# EasyEDA Pro project ProPrj_ax_driver_2025-11-09.epro, schematic axdr_v1.3
Board Name: 1.axdr_v1.3; Create Date: 2025-03-23; Page Name: P1; Project Name: 基于STM32G4的FOC电机驱动学习板; Schematic Name: axdr_v1.3; Update Date: 2025-03-23; Company: 嘉立创EDA
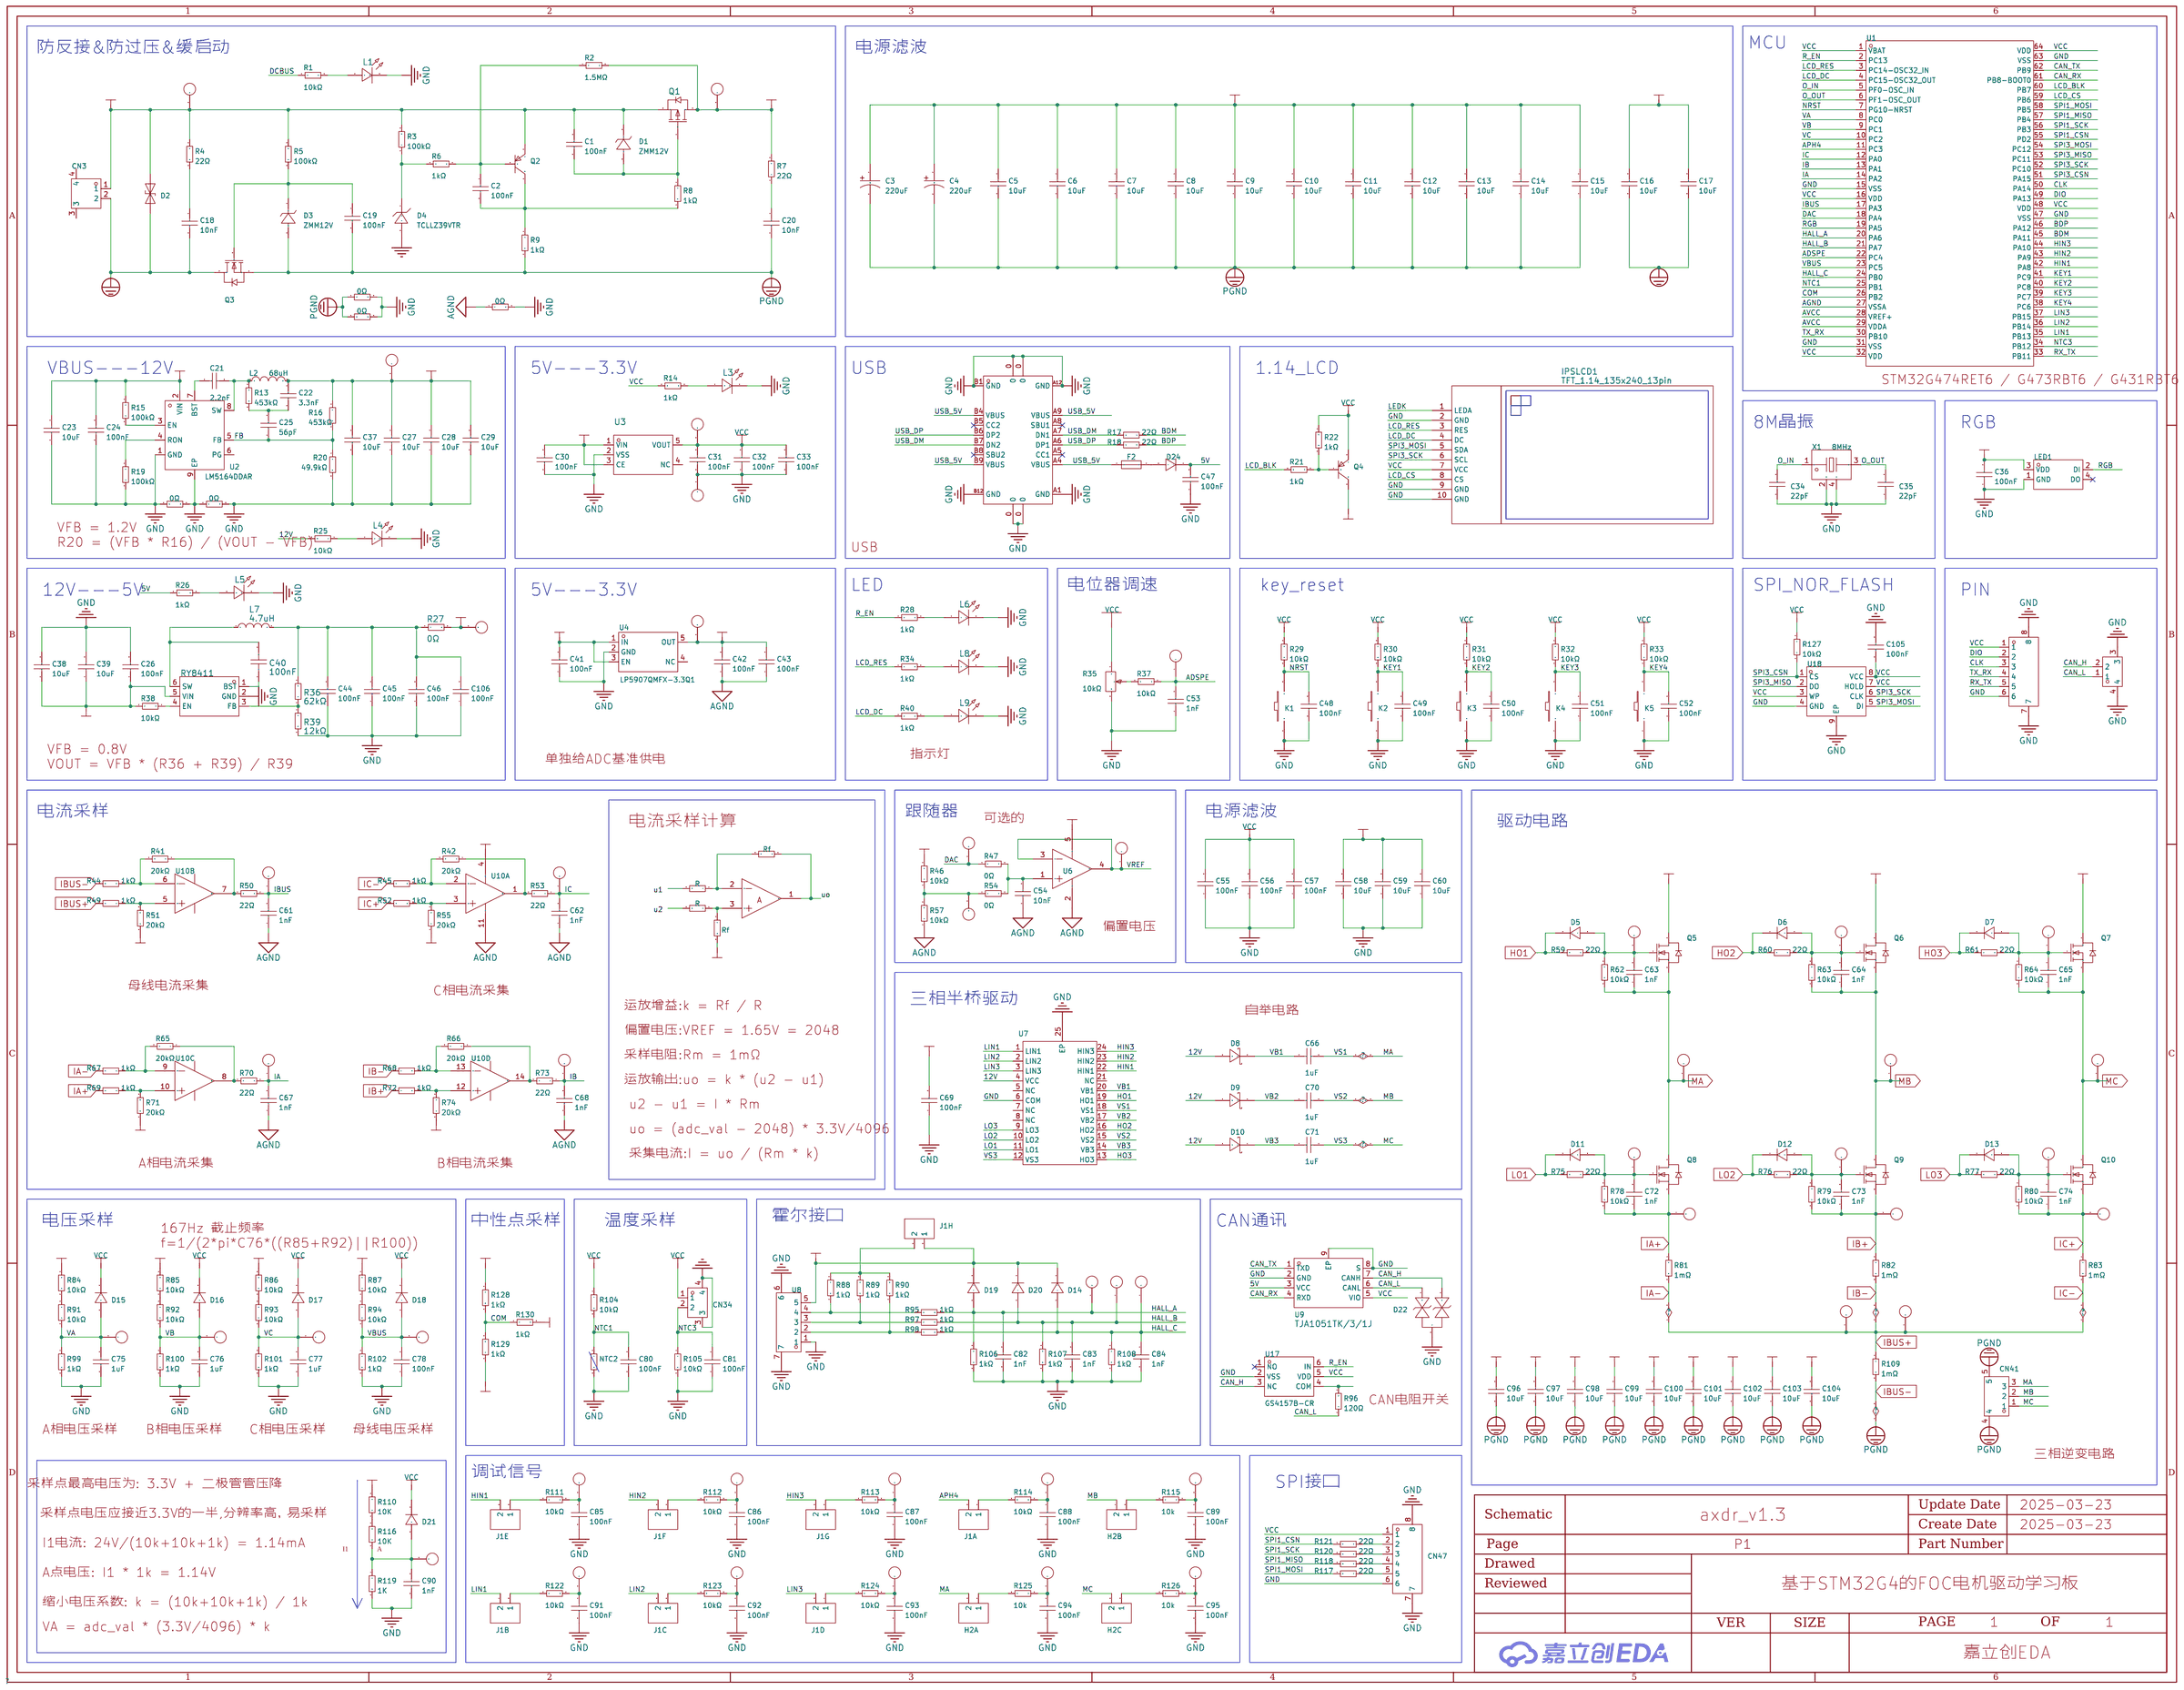
[diagram p1: schematic sheet]

## Parts
C1  100nF  [C0603_S]
C2  100nF  [C0603_S]
C3  220uF  [CAP-SMD_BD10.0-L10.3-W10.3-LS11.0-R-RD]
C4  220uF  [CAP-SMD_BD10.0-L10.3-W10.3-LS11.0-R-RD]
C5  10uF  [C1206_S]
C6  10uF  [C1206_S]
C7  10uF  [C1206_S]
C8  10uF  [C1206_S]
C9  10uF  [C1206_S]
C10  10uF  [C1206_S]
C11  10uF  [C1206_S]
C12  10uF  [C1206_S]
C13  10uF  [C1206_S]
C14  10uF  [C1206_S]
C15  10uF  [C1206_S]
C16  10uF  [C1206_S]
C17  10uF  [C1206_S]
C18  10nF  [C0603_S]
C19  100nF  [C0603_S]
C20  10nF  [C0603_S]
C21  2.2nF  [C0603_S]
C22  3.3nF  [C0603_S]
C23  10uF  [C1206_S]
C24  100nF  [C1206_S]
C25  2.2nF  [C0603_S]
C26  100nF  [C0603_S]
C27  10uF  [C0603_S]
C28  10uF  [C0603_S]
C29  10uF  [C1206_S]
C30  100nF  [C0603_S]
C31  100nF  [C0603_S]
C32  100nF  [C0603_S]
C33  100nF  [C0603_S]
C34  22pF  [C0603_S]
C35  22pF  [C0603_S]
C36  100nF  [C0603_S]
C37  10uF  [C0603_S]
C38  10uF  [C0603_S]
C39  10uF  [C0603_S]
C40  100nF  [C0603_S_3]
C41  100nF  [C0603_S]
C42  100nF  [C0603_S]
C43  100nF  [C0603_S]
C44  100nF  [C0603_S]
C45  100nF  [C0603_S]
C46  100nF  [C0603_S]
C47  100nF  [C0603_S]
C48  100nF  [C0603_S]
C49  100nF  [C0603_S]
C50  100nF  [C0603_S]
C51  100nF  [C0603_S]
C52  100nF  [C0603_S]
C53  1nF  [C0603_S]
C54  10nF  [C0603_S]
C55  100nF  [C0603_S]
C56  100nF  [C0603_S]
C57  100nF  [C0603_S]
C58  10uF  [C0603_S]
C59  10uF  [C0603_S]
C60  10uF  [C0603_S]
C61  1nF  [C0603_S]
C62  1nF  [C0603_S]
C63  1nF  [C0603_S]
C64  1nF  [C0603_S]
C65  1nF  [C0603_S]
C66  1uF  [C0603_S]
C67  1nF  [C0603_S]
C68  1nF  [C0603_S]
C69  100nF  [C0603_S]
C70  1uF  [C0603_S]
C71  1uF  [C0603_S]
C72  1nF  [C0603_S]
C73  1nF  [C0603_S]
C74  1nF  [C0603_S]
C75  1uF  [C0603_S]
C76  1uF  [C0603_S]
C77  1uF  [C0603_S]
C78  100nF  [C0603_S]
C80  100nF  [C0603_S]
C81  100nF  [C0603_S]
C82  1nF  [C0603_S]
C83  1nF  [C0603_S]
C84  1nF  [C0603_S]
C85  100nF  [C0603_S]
C86  100nF  [C0603_S]
C87  100nF  [C0603_S]
C88  100nF  [C0603_S]
C89  100nF  [C0603_S]  (no BOM)
C90  1nF  [C0603_S]  (no BOM)
C91  100nF  [C0603_S]
C92  100nF  [C0603_S]
C93  100nF  [C0603_S]
C94  100nF  [C0603_S]  (no BOM)
C95  100nF  [C0603_S]  (no BOM)
C96  10uF  [C1206_S]
C97  10uF  [C1206_S]
C98  10uF  [C1206_S]
C99  10uF  [C1206_S]
C100  10uF  [C1206_S]
C101  10uF  [C1206_S]
C102  10uF  [C1206_S]
C103  10uF  [C1206_S]
C104  10uF  [C1206_S]
C105  100nF  [C0603_S]
C106  100nF  [C0603_S]
CN1  5012  [TESTPOINT-TH_BD2.0_C9900010656]  (no BOM)
CN2  5012  [TESTPOINT-TH_BD2.0_C9900010656]  (no BOM)
CN3  XT30PW-F  [CONN-TH_XT30PW-F]
CN4  5012  [TESTPOINT-TH_BD2.0_C9900010656]  (no BOM)
CN5  5012  [TESTPOINT-TH_BD2.0_C9900010656]  (no BOM)
CN6  5012  [TESTPOINT-TH_BD2.0_C9900010656]  (no BOM)
CN7  5012  [TESTPOINT-TH_BD2.0_C9900010656]  (no BOM)
CN8  5012  [TESTPOINT-TH_BD2.0_C9900010656]  (no BOM)
CN9  WAFER-GH1.25-6PWB  [CONN-SMD_6P-P1.25_XUNPU_WAFER-GH1.25-6PWB]
CN10  5012  [TESTPOINT-TH_BD2.0_C9900010656]  (no BOM)
CN11  X1251WRS-02HF-LPSW  [CONN-SMD_2P-P1.25_X1251WRS-02HF-LPSW]
CN12  5012  [TESTPOINT-TH_BD2.0_C9900010656]  (no BOM)
CN13  5012  [TESTPOINT-TH_BD2.0_C9900010656]  (no BOM)
CN14  5012  [TESTPOINT-TH_BD2.0_C9900010656]  (no BOM)
CN15  5012  [TESTPOINT-TH_BD2.0_C9900010656]  (no BOM)
CN16  5012  [TESTPOINT-TH_BD2.0_C9900010656]  (no BOM)
CN17  5012  [TESTPOINT-TH_BD2.0_C9900010656]  (no BOM)
CN18  5012  [TESTPOINT-TH_BD2.0_C9900010656]  (no BOM)
CN19  5012  [TESTPOINT-TH_BD2.0_C9900010656]  (no BOM)
CN20  5012  [TESTPOINT-TH_BD2.0_C9900010656]  (no BOM)
CN21  5012  [TESTPOINT-TH_BD2.0_C9900010656]  (no BOM)
CN22  5012  [TESTPOINT-TH_BD2.0_C9900010656]  (no BOM)
CN23  5012  [TESTPOINT-TH_BD2.0_C9900010656]  (no BOM)
CN24  5012  [TESTPOINT-TH_BD2.0_C9900010656]  (no BOM)
CN25  5012  [TESTPOINT-TH_BD2.0_C9900010656]  (no BOM)
CN26  5012  [TESTPOINT-TH_BD2.0_C9900010656]  (no BOM)
CN27  5012  [TESTPOINT-TH_BD2.0_C9900010656]  (no BOM)
CN28  5012  [TESTPOINT-TH_BD2.0_C9900010656]  (no BOM)
CN29  5012  [TESTPOINT-TH_BD2.0_C9900010656]  (no BOM)
CN30  5012  [TESTPOINT-TH_BD2.0_C9900010656]  (no BOM)
CN31  5012  [TESTPOINT-TH_BD2.0_C9900010656]  (no BOM)
CN32  5012  [TESTPOINT-TH_BD2.0_C9900010656]  (no BOM)
CN33  5012  [TESTPOINT-TH_BD2.0_C9900010656]  (no BOM)
CN34  X1251WRS-02HF-LPSW  [CONN-SMD_2P-P1.25_X1251WRS-02HF-LPSW]
CN35  5012  [TESTPOINT-TH_BD2.0_C9900010656]  (no BOM)
CN36  5012  [TESTPOINT-TH_BD2.0_C9900010656]  (no BOM)
CN37  5012  [TESTPOINT-TH_BD2.0_C9900010656]  (no BOM)
CN38  5012  [TESTPOINT-TH_BD2.0_C9900010656]  (no BOM)
CN39  5012  [TESTPOINT-TH_BD2.0_C9900010656]  (no BOM)
CN40  5012  [TESTPOINT-TH_BD2.0_C9900010656]  (no BOM)
CN41  MR30PW-F  [CONN-TH_MR30PW-F]
CN42  5012  [TESTPOINT-TH_BD2.0_C9900010656]  (no BOM)
CN43  5012  [TESTPOINT-TH_BD2.0_C9900010656]  (no BOM)
CN44  5012  [TESTPOINT-TH_BD2.0_C9900010656]  (no BOM)
CN45  5012  [TESTPOINT-TH_BD2.0_C9900010656]  (no BOM)
CN46  5012  [TESTPOINT-TH_BD2.0_C9900010656]  (no BOM)
CN47  WAFER-GH1.25-6PWB  [CONN-SMD_6P-P1.25_XUNPU_WAFER-GH1.25-6PWB]
CN48  5012  [TESTPOINT-TH_BD2.0_C9900010656]  (no BOM)
CN49  5012  [TESTPOINT-TH_BD2.0_C9900010656]  (no BOM)
CN50  5012  [TESTPOINT-TH_BD2.0_C9900010656]  (no BOM)
CN51  5012  [TESTPOINT-TH_BD2.0_C9900010656]  (no BOM)
CN52  5012  [TESTPOINT-TH_BD2.0_C9900010656]  (no BOM)
CN53  5012  [TESTPOINT-TH_BD2.0_C9900010656]  (no BOM)
D1  ZMM12V  [LL-34_L3.5-W1.5-RD-2]
D2  1.5SMC30CAHE3/57T  [SMC_L6.8-W5.9-LS7.8-BI]
D3  ZMM12V  [LL-34_L3.5-W1.5-RD-2]
D4  TCLLZ39VTR  [LL-34_L3.5-W1.5-RD]
D5  B16WS  [SOD-323_L1.8-W1.3-LS2.5-RD]
D6  B16WS  [SOD-323_L1.8-W1.3-LS2.5-RD]
D7  B16WS  [SOD-323_L1.8-W1.3-LS2.5-RD]
D8  B16WS  [SOD-323_L1.8-W1.3-LS2.5-RD]
D9  B16WS  [SOD-323_L1.8-W1.3-LS2.5-RD]
D10  B16WS  [SOD-323_L1.8-W1.3-LS2.5-RD]
D11  B16WS  [SOD-323_L1.8-W1.3-LS2.5-RD]
D12  B16WS  [SOD-323_L1.8-W1.3-LS2.5-RD]
D13  B16WS  [SOD-323_L1.8-W1.3-LS2.5-RD]
D14  B16WS  [SOD-323_L1.8-W1.3-LS2.5-RD]
D15  B16WS  [SOD-323_L1.8-W1.3-LS2.5-RD]
D16  B16WS  [SOD-323_L1.8-W1.3-LS2.5-RD]
D17  B16WS  [SOD-323_L1.8-W1.3-LS2.5-RD]
D18  B16WS  [SOD-323_L1.8-W1.3-LS2.5-RD]
D19  B16WS  [SOD-323_L1.8-W1.3-LS2.5-RD]
D20  B16WS  [SOD-323_L1.8-W1.3-LS2.5-RD]
D21  -  [SOD-323_L1.8-W1.3-LS2.5-RD]  (no BOM)
D22  NUP2105LT1G  [SOT-23-3_L2.9-W1.3-P1.90-LS2.4-BR]
D24  B16WS  [SOD-323_L1.8-W1.3-LS2.5-RD]
F2  BSMD0603-050-6V  [F0603]
H2  X6521WV-2x03H-C60D30  [HDR-TH_6P-P2.54-V-M-R2-C3-S2.54]  (sections 1,2,3)  (no BOM)
IPSLCD1  TFT_1.14_135x240_13pin  [焊接式_TFT_1.14_135X240_13PIN]
J1  2.0-2*8P针  [HDR-TH_16P-P2.00-V-M-R2-C8-S2.00]  (sections 1,2,3,4,5,6,7,8)
K1  TS-KG02S  [SW-SMD_4P-L6.0-W6.0-P4.50-LS8.5]
K2  TS-KG02S  [SW-SMD_4P-L6.0-W6.0-P4.50-LS8.5]
K3  TS-KG02S  [SW-SMD_4P-L6.0-W6.0-P4.50-LS8.5]
K4  TS-KG02S  [SW-SMD_4P-L6.0-W6.0-P4.50-LS8.5]
K5  TS-KG02S  [SW-SMD_4P-L6.0-W6.0-P4.50-LS8.5]
L1  NCD0603R1  [LED0603_S]
L2  68uH  [IND-SMD_L6.0-W6.0_SMNR6045]
L3  NCD0603R1  [LED0603_S]
L4  NCD0603R1  [LED0603_S]
L5  NCD0603R1  [LED0603_S]
L6  NCD0603G1  [LED0603_S]
L7  4.7uH  [IND-SMD_L2.5-W2.0]
L8  NCD0603W1  [LED0603_S]
L9  NCD0603B1  [LED0603_S]
LED1  XL-3528RGBW-WS2812B  [LED-SMD_4P-L3.5-W2.8-BR-1]
NTC2  NCP18XH103F03RB  [R0603_S]
Q1  WSD90P06DN56  [DFN-8_L5.8-W4.9-P1.27-LS6.0-BL-1]
Q2  FMMT593  [SOT-23-3_L2.9-W1.3-P1.90-LS2.4-BR]
Q3  WSD80120DN56  [DFN-8_L5.8-W4.9-P1.27-LS6.0-BL-1]
Q4  S8550  [SOT-23-3_L2.9-W1.3-P1.90-LS2.4-BR]
Q5  NCE7560K  [TO-252-2_L6.6-W6.1-P4.58-LS9.9-BR]
Q6  NCE7560K  [TO-252-2_L6.6-W6.1-P4.58-LS9.9-BR]
Q7  NCE7560K  [TO-252-2_L6.6-W6.1-P4.58-LS9.9-BR]
Q8  NCE7560K  [TO-252-2_L6.6-W6.1-P4.58-LS9.9-BR]
Q9  NCE7560K  [TO-252-2_L6.6-W6.1-P4.58-LS9.9-BR]
Q10  NCE7560K  [TO-252-2_L6.6-W6.1-P4.58-LS9.9-BR]
R1  10kΩ  [R0603_S]
R2  1.5MΩ  [R0603_S]
R3  100kΩ  [R0603_S]
R4  22Ω  [R0603_S]
R5  100kΩ  [R0603_S]
R6  1kΩ  [R0603_S]
R7  22Ω  [R0603_S]
R8  1kΩ  [R0603_S]
R9  1kΩ  [R0603_S]
R10  0Ω  [R0603_S]
R11  0Ω  [R0603_S]
R12  0Ω  [R0603_S]
R13  453kΩ  [R0603_S]
R14  1kΩ  [R0603_S]
R15  100kΩ  [R0603_S]
R16  453kΩ  [R0603_S]
R17  22Ω  [R0603_S]
R18  22Ω  [R0603_S]
R19  100kΩ  [R0603_S]
R20  49.9kΩ  [R0603_S]
R21  1kΩ  [R0603_S]
R22  1kΩ  [R0603_S]
R23  0Ω  [R0603_S]
R24  0Ω  [R0603_S]
R25  10kΩ  [R0603_S]
R26  1kΩ  [R0603_S]
R27  0Ω  [R0603_S]
R28  1kΩ  [R0603_S]
R29  10kΩ  [R0603_S]
R30  10kΩ  [R0603_S]
R31  10kΩ  [R0603_S]
R32  10kΩ  [R0603_S]
R33  10kΩ  [R0603_S]
R34  1kΩ  [R0603_S]
R35  10kΩ  [RES-ADJ-TH_3P-L9.5-W9.5-P2.50-L_3386P]
R36  62kΩ  [R0603_S]
R37  10kΩ  [R0603_S]
R38  10kΩ  [R0603_S]
R39  12kΩ  [R0603_S]
R40  1kΩ  [R0603_S]
R41  20kΩ  [R0603_S]
R42  20kΩ  [R0603_S]
R43  Rf  [R0603_S]  (no BOM)
R44  1kΩ  [R0603_S]
R45  1kΩ  [R0603_S]
R46  10kΩ  [R0603_S]
R47  0Ω  [R0603_S]
R48  R  [R0603_S]  (no BOM)
R49  1kΩ  [R0603_S]
R50  22Ω  [R0603_S]
R51  20kΩ  [R0603_S]
R52  1kΩ  [R0603_S]
R53  22Ω  [R0603_S]
R54  0Ω  [R0603_S]
R55  20kΩ  [R0603_S]
R56  R  [R0603_S]  (no BOM)
R57  10kΩ  [R0603_S]
R58  Rf  [R0603_S]  (no BOM)
R59  22Ω  [R0603_S]
R60  22Ω  [R0603_S]
R61  22Ω  [R0603_S]
R62  10kΩ  [R0603_S]
R63  10kΩ  [R0603_S]
R64  10kΩ  [R0603_S]
R65  20kΩ  [R0603_S]
R66  20kΩ  [R0603_S]
R67  1kΩ  [R0603_S]
R68  1kΩ  [R0603_S]
R69  1kΩ  [R0603_S]
R70  22Ω  [R0603_S]
R71  20kΩ  [R0603_S]
R72  1kΩ  [R0603_S]
R73  22Ω  [R0603_S]
R74  20kΩ  [R0603_S]
R75  22Ω  [R0603_S]
R76  22Ω  [R0603_S]
R77  22Ω  [R0603_S]
R78  10kΩ  [R0603_S]
R79  10kΩ  [R0603_S]
R80  10kΩ  [R0603_S]
R81  1mΩ  [R2512_S]
R82  1mΩ  [R2512_S]
R83  1mΩ  [R2512_S]
R84  10kΩ  [R0603_S]
R85  15kΩ  [R0603_S]
R86  15kΩ  [R0603_S]
R87  15kΩ  [R0603_S]
R88  1kΩ  [R0603_S]
R89  1kΩ  [R0603_S]
R90  1kΩ  [R0603_S]
R91  15kΩ  [R0603_S]
R92  15kΩ  [R0603_S]
R93  15kΩ  [R0603_S]
R94  15kΩ  [R0603_S]
R95  1kΩ  [R0603_S]
R96  120Ω  [R0603_S]
R97  1kΩ  [R0603_S]
R98  1kΩ  [R0603_S]
R99  2kΩ  [R0603_S]
R100  2kΩ  [R0603_S]
R101  2kΩ  [R0603_S]
R102  2kΩ  [R0603_S]
R104  10kΩ  [R0603_S]
R105  10kΩ  [R0603_S]
R106  1kΩ  [R0603_S]
R107  1kΩ  [R0603_S]
R108  1kΩ  [R0603_S]
R109  1mΩ  [R2512_S]
R110  10K  [R0603_S]  (no BOM)
R111  10kΩ  [R0603_S]
R112  10kΩ  [R0603_S]
R113  10kΩ  [R0603_S]
R114  10kΩ  [R0603_S]
R115  10k  [R0603_S]  (no BOM)
R116  10K  [R0603_S]  (no BOM)
R117  22Ω  [R0603_S]
R118  22Ω  [R0603_S]
R119  1K  [R0603_S]  (no BOM)
R120  22Ω  [R0603_S]
R121  22Ω  [R0603_S]
R122  10kΩ  [R0603_S]
R123  10kΩ  [R0603_S]
R124  10kΩ  [R0603_S]
R125  10k  [R0603_S]  (no BOM)
R126  10k  [R0603_S]  (no BOM)
R127  10kΩ  [R0603_S]
R128  1kΩ  [R0603_S]
R129  1kΩ  [R0603_S]
R130  1kΩ  [R0603_S]
U1  STM32G431RBT6  [LQFP-64_L10.0-W10.0-P0.50-LS12.0-BL]
U2  LM5164DDAR  [ESOP-8_L4.9-W3.9-P1.27-LS6.0-BL-EP]
U3  XC6210B332MR  [SOT-23-5_L3.0-W1.7-P0.95-LS2.8-BR]
U4  LP5907QMFX-3.3Q1  [SOT-23-5_L3.0-W1.7-P0.95-LS2.8-BR]
U5  RY8411  [SOT-23-6_L2.9-W1.6-P0.95-LS2.8-BR]
U6  LM321MF/NOPB  [SOT-23-5_L3.0-W1.7-P0.95-LS2.8-BR]
U7  FD6288Q  [QFN-24_L4.0-W4.0-P0.50-BL-EP2.6]
U8  WAFER-GH1.25-5PWB  [CONN-SMD_5P-P1.25_XUNPU_WAFER-GH1.25-5PWB]
U9  TJA1051TK/3/1J  [HVSON-8_L3.0-W3.0-P0.65-BL-EP]
U10  RS624XQ  [TSSOP-14_L5.0-W4.4-P0.65-LS6.4-BL]  (sections 1,2,3,4)
U11  LM358  [SOP-8_L4.9-W3.9-P1.27-LS6.0-BL]  (section 1)  (no BOM)
U17  GS4157B-CR  [SC70-6_L2.1-W1.3-P0.65-LS2.3-BL]
U18  W25Q16JVUXIQ  [USON-8_L3.0-W2.0-P0.50-BL-EP]
USBC1  -  [USB-C_SMD-TYPE-C-31-M-12]
X1  8MHz  [CRYSTAL-SMD_4P-L3.2-W2.5-BL]

## Library data of the parts
C1 C2 C19 C26 C30-C33 C36 C41-C52 C55-C57 C69 C82-C88 C91-C93 C105 C106 = 0603B104K500NT: 容值:100nF;精度:±10%;额定电压:50V;材质(温度系数):X7R;; LCSC Part Name: 100nF ±10% 50V; Supplier Part: C30926; Manufacturer: FH(风华); Supplier Footprint: 0603; JLCPCB Part Class: Extended Part; Datasheet: https://atta.szlcsc.com/upload/public/pdf/source/20200305/C486355_26A10D38EF8C2A5C37091D0039909270.pdf; Supplier: LCSC; Tolerance: ±10%; Voltage Rated: 50V; Temperature Coefficient: X7R; Pin Type: IN; Check: true
C3 C4 = 50TZV220M10X10.5: 容值:220uF;精度:±20%;额定电压:50V;纹波电流:402mA@120Hz;等效串联电阻:-;; LCSC Part Name: 220uF ±20% 50V; Supplier Part: C88818; Manufacturer: rubycon(红宝石); Supplier Footprint: SMD,D10xL10.5mm; JLCPCB Part Class: Extended Part; Datasheet: https://atta.szlcsc.com/upload/public/pdf/source/20171014/C108861_15079752546651037911.pdf; Supplier: LCSC; Tolerance: ±20%; Rated Voltage: 50V; Ripple Current: 402mA@120Hz; φD: 10mm; L: 10.5mm; Lifetime @ Temp: 2000hrs@105℃; Operating Temperature: -55℃~+105℃; Check: true
C5-C17 C29 C96-C104 = CL31A106KBHNNNE: 容值:10uF;精度:±10%;额定电压:50V;材质(温度系数):X5R;; LCSC Part Name: 10uF ±10% 50V; Supplier Part: C13585; Manufacturer: SAMSUNG(三星); Supplier Footprint: 1206; JLCPCB Part Class: Basic Part; Datasheet: https://atta.szlcsc.com/upload/public/pdf/source/20160218/1457707763339.pdf; Supplier: LCSC; Tolerance: ±10%; Voltage Rated: 50V; Temperature Coefficient: X5R; Pin Type: IN; 值: 10UF; Check: true
C18 C20 C54 = 0603B103K500NT: 容值:10nF;精度:±10%;额定电压:50V;材质(温度系数):X7R;; LCSC Part Name: 10nF ±10% 50V; Supplier Part: C57112; Manufacturer: FH(风华); Supplier Footprint: 0603; JLCPCB Part Class: Basic Part; Datasheet: https://atta.szlcsc.com/upload/public/pdf/source/20200305/C486355_26A10D38EF8C2A5C37091D0039909270.pdf; Supplier: LCSC; Tolerance: ±10%; Voltage Rated: 50V; Temperature Coefficient: X7R; Pin Type: IN; Check: true
C21 C25 = 0603B222K500NT: 容值:2.2nF;精度:±10%;额定电压:50V;材质(温度系数):X7R;; LCSC Part Name: 2.2nF ±10% 50V; Supplier Part: C1604; Manufacturer: FH(风华); Supplier Footprint: 0603; JLCPCB Part Class: Basic Part; Datasheet: https://atta.szlcsc.com/upload/public/pdf/source/20200305/C486355_26A10D38EF8C2A5C37091D0039909270.pdf; Supplier: LCSC; Tolerance: ±10%; Voltage Rated: 50V; Temperature Coefficient: X7R; Pin Type: IN; Check: true
C22 = CL10B332KB8NNNC: 容值:3.3nF;精度:±10%;额定电压:50V;材质(温度系数):X7R;; LCSC Part Name: 3.3nF ±10% 50V; Supplier Part: C1613; Manufacturer: SAMSUNG(三星); Supplier Footprint: 0603; JLCPCB Part Class: Basic Part; Datasheet: https://atta.szlcsc.com/upload/public/pdf/source/20160218/1457707763339.pdf; Supplier: LCSC; Tolerance: ±10%; Voltage Rated: 50V; Temperature Coefficient: X7R; Pin Type: IN; Check: true
C23 = C1206_S: Pin Type: IN; Supplier Part: C13585; Check: true
C24 = CL31B104KBCNNNC: 容值:100nF;精度:±10%;额定电压:50V;材质(温度系数):X7R;; LCSC Part Name: 100nF ±10% 50V; Supplier Part: C24497; Manufacturer: SAMSUNG(三星); Supplier Footprint: 1206; JLCPCB Part Class: Basic Part; Datasheet: https://atta.szlcsc.com/upload/public/pdf/source/20160218/1457707763339.pdf; Supplier: LCSC; Tolerance: ±10%; Voltage Rated: 50V; Temperature Coefficient: X7R; Pin Type: IN; Check: true
C27 C28 C37-C39 C58-C60 = CL10A106MA8NRNC: 容值:10uF;精度:±20%;额定电压:25V;材质(温度系数):X5R;; LCSC Part Name: 10uF ±20% 25V; Supplier Part: C96446; Manufacturer: SAMSUNG(三星); Supplier Footprint: 0603; JLCPCB Part Class: Basic Part; Datasheet: https://atta.szlcsc.com/upload/public/pdf/source/20160218/1457707763339.pdf; Supplier: LCSC; Tolerance: ±20%; Voltage Rated: 25V; Temperature Coefficient: X5R; Pin Type: IN; Check: true
C34 C35 = 0603CG220J500NT: 容值:22pF;精度:±5%;额定电压:50V;材质(温度系数):C0G;; LCSC Part Name: 22pF ±5% 50V; Supplier Part: C91701; Manufacturer: FH(风华); Supplier Footprint: 0603; JLCPCB Part Class: Extended Part; Datasheet: https://atta.szlcsc.com/upload/public/pdf/source/20200305/C486355_26A10D38EF8C2A5C37091D0039909270.pdf; Supplier: LCSC; Tolerance: ±5%; Voltage Rated: 50V; Temperature Coefficient: C0G; Pin Type: IN; Check: true
C40 = CC0603KRX7R9BB104: 容值:100nF;精度:±10%;额定电压:50V;材质(温度系数):X7R;; LCSC Part Name: 100nF ±10% 50V; Supplier Part: C14663; Manufacturer: YAGEO(国巨); Supplier Footprint: 0603; JLCPCB Part Class: Basic Part; Datasheet: https://atta.szlcsc.com/upload/public/pdf/source/20180910/C282072_33301C7F631E79921B82A8DAC6BCC5B3.pdf; Supplier: LCSC; Tolerance: ±10%; Voltage Rated: 50V; Temperature Coefficient: X7R; Check: true
C53 C61-C65 C67 C68 C72-C78 C80 C81 = 0603B102K500NT: 容值:1nF;精度:±10%;额定电压:50V;材质(温度系数):X7R;; LCSC Part Name: 1nF ±10% 50V; Supplier Part: C44369; Manufacturer: FH(风华); Supplier Footprint: 0603; JLCPCB Part Class: Extended Part; Datasheet: https://atta.szlcsc.com/upload/public/pdf/source/20200305/C486355_26A10D38EF8C2A5C37091D0039909270.pdf; Supplier: LCSC; Tolerance: ±10%; Voltage Rated: 50V; Temperature Coefficient: X7R; Pin Type: IN; Check: true
C66 C70 C71 C89 C90 C94 C95 = C0603_S: Pin Type: IN; Supplier Part: C1604; Check: true
CN1 CN2 CN4-CN8 CN10 CN12-CN33 CN35-CN40 CN42-CN46 CN48-CN53 = 5012: LCSC Part Name: 测试点; Supplier Part: C2906766; Manufacturer: Keystone; JLCPCB Part Class: ExtendedPart; Datasheet: https://atta.szlcsc.com/upload/public/pdf/source/20211102/12102DF701EA335825673F0350517149.pdf; Supplier: LCSC; Check: true
CN3 = XT30PW-F: 类别:-;类型1:-;; LCSC Part Name: AMASS(艾迈斯)电源连接器 母头 XT30PW-F; Supplier Part: C2913282; Manufacturer: AMASS(艾迈斯); JLCPCB Part Class: Extended Part; Datasheet: https://atta.szlcsc.com/upload/public/pdf/source/20190916/C428722_DFF78979486FCB0B58C1FC563067EC88.pdf; Supplier: LCSC; Brand: 艾迈斯; Type: 航模插头; InterfaceType: 母头; Check: true
CN9 CN47 = WAFER-GH1.25-6PWB: 参考系列:GH;间距:1.25mm;插针结构:1x6P;排数:1;每排PIN数:6;公母:公型插针;安装方式:卧贴;额定电流:1A;工作温度范围:-25~+85;; LCSC Part Name: GH1.25mm6P卧贴带扣带扣; Supplier Part: C3029381; Manufacturer: XUNPU(讯普); Supplier Footprint: SMD,P=1.25mm; JLCPCB Part Class: ExtendedPart; Datasheet: https://atta.szlcsc.com/upload/public/pdf/source/20220527/CB8773BFB0913C3B8ABD62CB38BA101A.pdf; Supplier: LCSC; Reference Series: GH; Pitch: 1.25mm; Pins Structure: 1x6P; Number of Rows: 1; Number of PINs Per Row: 6; Gender: 公型插针; Mounting Style: 卧贴; Current Rating (Max): 1A; Operating Temperature Range: -25~+85; Check: true
CN11 CN34 = X1251WRS-02HF-LPSW: 插针结构:1x2P;间距:1.25mm;安装方式:卧贴;行距:-;总PIN数:2P;排数:1;每排PIN数:2;参考系列:GH;额定电流:1A;触头材质:磷青铜;触头镀层:锡;工作温度范围:-40℃~+110℃;; LCSC Part Name: 1x2P 间距:1.25mm 卧贴 系列:GH GH; Supplier Part: C388707; Manufacturer: XKB Connectivity(中国星坤); Supplier Footprint: SMD,P=1.25mm; JLCPCB Part Class: Extended Part; Datasheet: https://atta.szlcsc.com/upload/public/pdf/source/20211011/E2F7306AE87519079AD4EC816349A567.pdf; Supplier: LCSC; Reference Series: GH; Pitch: 1.25mm; Pins Structure: 1x2P; Number of Rows: 1; Number of PINs Per Row: 2; Gender: 母型插口; Mounting Style: 卧贴; Current Rating (Max): 1A; Contact Material: 磷青铜; Contact Plating: 锡; Operating Temperature Range: -40℃~+110℃; Welding Temperature (Max): 260℃; Number of Pins: 2P; Check: true
CN41 = MR30PW-F: Supplier Part: C2928110; Supplier Footprint: Through hole; JLCPCB Part Class: Extended Part; Supplier: LCSC; Check: true
D1 D3 = ZMM12V: 二极管配置:独立式;稳压值(标称值):12V;稳压值(范围):11.4V~12.7V;功率:500mW;精度:±5%;; Supplier Part: C2891753; Manufacturer: YONGYUTAI(永裕泰); Supplier Footprint: LL-34; JLCPCB Part Class: Extended Part; Datasheet: https://atta.szlcsc.com/upload/public/pdf/source/20210901/1E62BEB6ADBB84BC625F53DAC2865793.pdf; Supplier: LCSC; Diode Configuration: 独立式; Zener Voltage (Nom): 12V; Zener Voltage (Range): 11.4V~12.7V; Power Dissipation: 500mW; Zener Impedance (Zzt): 20Ω; Tolerance: ±5%; Check: true
D2 = 1.5SMC30CAHE3/57T: Supplier Part: C266791; Manufacturer: VISHAY(威世); Supplier Footprint: DO-214AB; JLCPCB Part Class: ExtendedPart; Datasheet: https://atta.szlcsc.com/upload/public/pdf/source/20201127/C266791_DCFCBF6E8C40544EF502CA57B31F9E9C.pdf; Supplier: LCSC; Check: true
D4 = TCLLZ39VTR: 二极管配置:独立式;稳压值(标称值):39V;精度:±5%;功率:500mW;; Supplier Part: C261065; Manufacturer: TC(德昌); Supplier Footprint: LL-34; JLCPCB Part Class: Extended Part; Datasheet: https://atta.szlcsc.com/upload/public/pdf/source/20180730/C261180_0E55EF1E5C6C97B03D9678EA0A24BCDF.pdf; Supplier: LCSC; Diode Configuration: 独立式; Zener Voltage (Nom): 39V; Tolerance: ±5%; Power Dissipation: 500mW; Reverse Leakage Current (Ir): 200nA@30V; Zener Impedance (Zzt): 85Ω; Zener Voltage (Range): 31V~35V; Check: true
D5-D7 D11-D20 D24 = B16WS_C364278: 直流反向耐压(Vr):60V;平均整流电流(Io):1A;正向压降(Vf):700mV@1A;; Supplier Part: C364278; Manufacturer: MDD; Supplier Footprint: SOD-323; JLCPCB Part Class: Extended Part; Datasheet: https://atta.szlcsc.com/upload/public/pdf/source/20190125/C364278_08C9E980565605CB111C36D3361AA1D7.pdf; Supplier: LCSC; Reverse Voltage (Vr): 60V; Average Rectified Current (Io): 1A; Forward Voltage (Vf@If): 700mV@1A; Check: true
D8-D10 = B16WS_C364278: 直流反向耐压(Vr):40V;平均整流电流(Io):1A;正向压降(Vf):650mV@1A;; Supplier Part: C364278; Manufacturer: MDD; Supplier Footprint: SOD-323; JLCPCB Part Class: Extended Part; Datasheet: https://atta.szlcsc.com/upload/public/pdf/source/20190125/C364278_08C9E980565605CB111C36D3361AA1D7.pdf; Supplier: LCSC; Reverse Voltage (Vr): 40V; Average Rectified Current (Io): 1A; Forward Voltage (Vf@If): 650mV@1A; Check: true
D21 = B16WS: 直流反向耐压(Vr):60V;平均整流电流(Io):1A;正向压降(Vf):700mV@1A;; LCSC Part Name: 60V1A700mV@1A; Supplier Part: C77282; Manufacturer: CJ（江苏长电/长晶）; Supplier Footprint: SOD-323; JLCPCB Part Class: ExtendedPart; Datasheet: https://atta.szlcsc.com/upload/public/pdf/source/20160702/1467448300850.pdf; Supplier: LCSC; Reverse Voltage (Vr): 60V; Average Rectified Current (Io): 1A; Forward Voltage (Vf@If): 700mV@1A; Check: true
D22 = NUP2105LT1G_C2890118: Supplier Part: C2890118; Manufacturer: TECH PUBLIC(台舟); Supplier Footprint: SOT-23; JLCPCB Part Class: 扩展库; Datasheet: https://atta.szlcsc.com/upload/public/pdf/source/20210903/C2631C2D315C3B4D2530AFC6AAB84809.pdf; Supplier: LCSC
F2 = BSMD0603-050-6V: 最大电压:6V;最大电流:40A;保持电流:500mA;跳闸电流:1A;; LCSC Part Name: 6V 500mA 0603自恢复; Supplier Part: C883095; Manufacturer: BHFUSE(佰宏); Supplier Footprint: 0603; JLCPCB Part Class: Extended Part; Datasheet: https://atta.szlcsc.com/upload/public/pdf/source/20230512/E478DE3555A0061DA0124A9F45802B86.pdf; Supplier: LCSC; Operating Voltage (Max): 6V; Current Rating (Max): 40A; Hold Current: 500mA; Trip Current: 1A; Power Dissipation: 500mW; Resistance - Initial (Ri) (Min): 100mΩ; Resistance - Post Trip (R1) (Max): 800mΩ; Maximum Time to Trip: 100ms; Operating Temperature: -40℃~+85℃
H2 = X6521WV-2x03H-C60D30: 排数:双排;总PIN位数:6P;间距:2.54mm;插针结构:2x3P;行距:2.54mm;安装类型:直插;圆针/方针:方针;额定电流:3A;额定电压:250V;配合针长度:6mm;塑高:2.5mm;端接针长度:3mm;触头材质:黄铜;触头镀层:金;工作温度范围:-40℃~+105℃;焊接温度(最大值):260℃;颜色:黑色;; Supplier: LCSC; Supplier Part: C706893; Manufacturer: XKB Connectivity(中国星坤); JLCPCB Part Class: 扩展库; LCSC Part Name: 2.54mm 2x3P 直插 方针 镀金足1U; Supplier Footprint: 插件,P=2.54mm; Datasheet: https://atta.szlcsc.com/upload/public/pdf/source/20211009/DE33EBA4104B5B447A7BD8383FBBA145.pdf; Number of Rows: 双排; Number of Pins: 6P; Pitch: 2.54mm; Pin Structure: 2x3P; Row Spacing: 2.54mm; Mounting Type: 直插; Circluar Pins/Square Pins: 方针; Current Rating (Max): 3A; Voltage Rating (Max): 250V; Length of Mating Pin: 6mm; Insulation Height: 2.5mm; Length of End Connection Pin: 3mm; Contact Material: 黄铜; Contact Plating: 金; Operating Temperature Range: -40℃~+105℃; Welding Temperature (Max): 260℃; Color: 黑色; Check: true
IPSLCD1 = 插接式_TFT_1.14_135x240_8pin: Check: true
J1 = 2.0-2*8P针: 排数:双排;总PIN位数:16P;间距:2.0mm;插针结构:-;行距:2.0mm;安装类型:直插;圆针/方针:-;额定电流:-;额定电压:-;配合针长度:-;塑高:-;触头材质:-;触头镀层:-;颜色:黑色;; LCSC Part Name: 间距:2.0mm 直插; Supplier Part: C71397; Manufacturer: BOOMELE(博穆精密); Supplier Footprint: 插件,P=2.0mm; JLCPCB Part Class: Extended Part; Datasheet: https://atta.szlcsc.com/upload/public/pdf/source/20221201/C605E3BE9C0F7226363017EFD1BDE852.pdf; Supplier: LCSC; Number of Rows: 双排; Number of Pins: 16P; Pitch: 2.54mm; Row Spacing: 2.54mm; Mounting Type: 直插; Color: 黑色
K1-K5 = TS-KG02S: 电路结构:单刀单掷;触点电流:50mA;额定电压(DC):12V;安装方式:立贴;绝缘电阻:100MΩ;带灯:-;机械寿命:-;; Supplier: LCSC; Supplier Part: C410366; Manufacturer: HANBO(汉博); JLCPCB Part Class: 扩展库; LCSC Part Name: 6*6*4.3mm 立贴 轻触开关; Supplier Footprint: SMD,6x6mm; Datasheet: https://atta.szlcsc.com/upload/public/pdf/source/20221110/4B16732C66B2A039D9853E84B21A4EEA.pdf; Circuit: 单刀单掷; Actuator Style: 圆形按钮; Switch Length: 6mm; Switch Width: 6mm; Switch Height: 4.3mm; Contact Current: 50mA; Voltage Rating (DC): 12V; Mounting Style: 立贴; Insulation Resistance: 100MΩ; Check: true
L1 L3-L5 = NCD0603R1_C84263: 发光颜色:红色;功率:65mW;透镜颜色:无色透明;主波长:615nm~630nm;发光强度:80mcd~220mcd;发光角度:130°;工作温度:-30℃~+85℃;; LCSC Part Name: 红灯 0603红灯   正贴; Supplier Part: C84263; Manufacturer: 国星光电; Supplier Footprint: 0603; JLCPCB Part Class: Extended Part; Datasheet: https://atta.szlcsc.com/upload/public/pdf/source/20200820/C84263_DABC6A75E58F576973B407FDBA283D60.pdf; Supplier: LCSC; Emitted Color: 红色; Forward Voltage (VF): 1.6V~2.6V; Forward Current: 20mA; Power Dissipation: 65mW; Lens Color: 无色透明; Dominant Wavelength: 615nm~630nm; Luminous Intensity: 80mcd~220mcd; Viewing Angle: 130°; Operating Temperature: -30℃~+85℃; Check: true
L2 = SMNR6045-680MT: 电感值:68uH;精度:±20%;额定电流:-;饱和电流(Isat):1.2A;; LCSC Part Name: 68uH ±20% 1.2A; Supplier Part: C135308; Manufacturer: SXN(顺翔诺); Supplier Footprint: SMD,6x6mm; JLCPCB Part Class: Extended Part; Datasheet: https://atta.szlcsc.com/upload/public/pdf/source/20210810/8C07D4BA256EC9B57FF3FBBF0FDAC34D.pdf; Supplier: LCSC; Tolerance: ±20%; Saturation Current (Isat): 1.2A; DC Resistance (DCR): 375mΩ; Check: true
L6 = NCD0603G1: 发光颜色:翠绿色;功率:72mW;透镜颜色:无色透明;主波长:515nm~530nm;发光强度:330mcd~900mcd;发光角度:130°;工作温度:-30℃~+85℃;; LCSC Part Name: 翠绿 0603翠绿  正贴; Supplier Part: C84267; Manufacturer: 国星光电; Supplier Footprint: 0603; JLCPCB Part Class: Extended Part; Datasheet: https://atta.szlcsc.com/upload/public/pdf/source/20200820/C84267_04BA7703640BAC111D09F5EFB971FBF3.pdf; Supplier: LCSC; Emitted Color: 翠绿色; Forward Voltage (VF): 2.6V~3.6V; Forward Current: 10mA; Power Dissipation: 72mW; Lens Color: 无色透明; Dominant Wavelength: 515nm~530nm; Luminous Intensity: 330mcd~900mcd; Viewing Angle: 130°; Operating Temperature: -30℃~+85℃; Check: true
L7 = MPIH252010-4R7M-LF: 电感值:4.7uH;精度:±20%;额定电流:1A;; LCSC Part Name: 4.7uH ±20% 1A 275mΩ; Supplier Part: C490449; Manufacturer: microgate(麦捷科技); Supplier Footprint: SMD; JLCPCB Part Class: Extended Part; Datasheet: https://atta.szlcsc.com/upload/public/pdf/source/20200707/C490443_2060EC88E48E101AE91DC68C352BCAF4.pdf; Supplier: LCSC; Tolerance: ±20%; Rated Current: 1A; DC Resistance (DCR): 275mΩ; Check: true
L8 = NCD0603W1: 发光颜色:白色;功率:72mW;透镜颜色:雾状黄;发光强度:200mcd~300mcd;发光角度:130°;工作温度:-30℃~+85℃;; LCSC Part Name: 白灯 0603白灯   正贴; Supplier Part: C84265; Manufacturer: 国星光电; Supplier Footprint: 0603; JLCPCB Part Class: Extended Part; Datasheet: https://atta.szlcsc.com/upload/public/pdf/source/20200820/C84265_479E6193713348A548E5CD6D9278BF16.pdf; Supplier: LCSC; Emitted Color: 白色; Forward Voltage (VF): 2.6V~3.6V; Forward Current: 5mA; Power Dissipation: 72mW; Lens Color: 雾状黄; Luminous Intensity: 200mcd~300mcd; Viewing Angle: 130°; Operating Temperature: -30℃~+85℃; Dominant Wavelength: 463nm~475nm; Check: true
L9 = NCD0603B1: 发光颜色:蓝色;功率:72mW;透镜颜色:无色透明;主波长:463nm~475nm;发光强度:80mcd~220mcd;发光角度:130°;工作温度:-30℃~+85℃;; LCSC Part Name: 蓝灯 0603蓝灯   正贴; Supplier Part: C84266; Manufacturer: 国星光电; Supplier Footprint: 0603; JLCPCB Part Class: Extended Part; Datasheet: https://atta.szlcsc.com/upload/public/pdf/source/20200820/C84266_6A3CDBEFA72C6CAD68EDA53474ADAE6C.pdf; Supplier: LCSC; Emitted Color: 蓝色; Forward Voltage (VF): 2.6V~3.6V; Forward Current: 10mA; Power Dissipation: 72mW; Lens Color: 无色透明; Dominant Wavelength: 463nm~475nm; Luminous Intensity: 80mcd~220mcd; Viewing Angle: 130°; Operating Temperature: -30℃~+85℃; Check: true
LED1 = XL-3528RGBW-WS2812B: 发光颜色:RGB三色;二极管配置:-;主波长:618nm~623nm；520nm~525nm；467nm~472nm;功率:50mW；50mW；45mW;安装方式:正贴;; LCSC Part Name: RGB三色 正贴 幻彩; Supplier Part: C2890364; Manufacturer: XINGLIGHT(成兴光); Supplier Footprint: SMD3528-4P; JLCPCB Part Class: 扩展库; Datasheet: https://atta.szlcsc.com/upload/public/pdf/source/20221102/50F456983F591359B0D81AA557777463.pdf; Supplier: LCSC; Emitted Color: RGB三色; Dominant Wavelength: 618nm~623nm；520nm~525nm；467nm~472nm; Peak Wavelength: 525nm；623nm；472nm; Forward Current: 20mA; Power Dissipation: 50mW；50mW；45mW; Viewing Angle: 120°; Mounting Sytle: 正贴; Operating Temperature: -25℃~+80℃; Check: true
NTC2 = NCP18XH103F03RB: 阻值(25℃):10kΩ;电阻精度:±1%;B值精度:±1%;B值(25℃/50℃):3380K;功率:100mW;最大稳态电流(25℃):310uA;B值(25℃/75℃):-;B值(25℃/85℃):3334K;B值(25℃/100℃):3455K;工作温度:-40℃~+125℃;; LCSC Part Name: 10kΩ 电阻精度:±1% 3380K; Supplier Part: C13564; Manufacturer: muRata(村田); Supplier Footprint: 0603; JLCPCB Part Class: Extended Part; Supplier: LCSC; Resistance @ 25℃: 10kΩ; Resistance Tolerance: ±1%; B Constant Tolerance: ±1%; B Constant (25℃/50℃): 3380K; Power: 100mW; Steady State Current (Max): 310uA; B Constant (25℃/85℃): 3334K; B Constant (25℃/100℃): 3455K; Operating Temperature: -40℃~+125℃; Pin Type: IN; Check: true
Q1 = WSD90P06DN56: 类型:P沟道;漏源电压(Vdss):60V;连续漏极电流(Id):90A;功率(Pd):96W;导通电阻(RDS(on)@Vgs,Id):10.5mΩ@10V,30A;阈值电压(Vgs(th)@Id):1.85V@250uA;; LCSC Part Name: P沟道 耐压:60V 电流:90A; Supplier Part: C719104; Manufacturer: WINSOK(微硕); Supplier Footprint: PDFN-8(4.9x5.8); JLCPCB Part Class: Extended Part; Datasheet: https://atta.szlcsc.com/upload/public/pdf/source/20220729/279518A307255699200471987C1169DA.pdf; Supplier: LCSC; Type: P沟道; Drain Source Voltage (Vdss): 60V; Continuous Drain Current (Id): 90A; Power Dissipation (Pd): 96W; Drain Source On Resistance (RDS(on)@Vgs,Id): 10.5mΩ@10V,30A; Gate Threshold Voltage (Vgs(th)@Id): 1.85V@250uA; Total Gate Charge (Qg@Vgs): 121nC@10V; Input Capacitance (Ciss@Vds): 5.6nF@30V; Reverse Transfer Capacitance (Crss@Vds): 480pF@30V; Operating Temperature: -55℃~+150℃@(Tj); Check: true
Q2 = FMMT593: 晶体管类型:PNP;集射极击穿电压(Vceo):100V;集电极电流(Ic):1A;功率(Pd):250mW;集电极-发射极饱和电压(VCE(sat)@Ic,Ib):300mV@500mA,50mA;直流电流增益(hFE@Ic,Vce):100@500mA,5V;特征频率(fT):150MHz;工作温度:+150@(Tj);; Supplier Part: C686648; Manufacturer: PJSEMI(平晶微); Supplier Footprint: SOT-23; JLCPCB Part Class: ExtendedPart; Datasheet: https://atta.szlcsc.com/upload/public/pdf/source/20200623/C686648_1A1010DCFFDFD669E9C9C5EDEB156CF4.pdf; Supplier: LCSC; Transistor Type: PNP; Collector-Emitter Breakdown Voltage (Vceo): 100V; Collector Current (Ic): 1A; Power Dissipation (Pd): 250mW; Collector-Emitter Saturation Voltage (VCE(sat)@Ic,Ib): 300mV@500mA,50mA; DC Current Gain (hFE@Ic,Vce): 100@500mA,5V; Transition Frequency (fT): 150MHz; Operating Temperature: +150@(Tj); Check: true
Q3 = WSD80120DN56: Configuration Single Type N-Ch VDS(V) 85 VGS(V) 25 ID(A)Max. 120 VGS(th)(v) 3 RDS(ON)(m?)@4.218V - Qg(nC)@4.5V - QgS(nC) 17 Qgd(nC) 11 Ciss(pF) 3750 Coss(pF) 395 Crss(pF) 180; Supplier Part: C2880467; Manufacturer: WINSOK(微硕); Supplier Footprint: DFN-8(4.9x5.8); JLCPCB Part Class: Extended Part; Datasheet: https://atta.szlcsc.com/upload/public/pdf/source/20210813/DD2210B50993633CFB622FAE7AD52E64.pdf; Supplier: LCSC; Check: true
Q4 = S8550_C20069126: 晶体管类型:PNP;集电极电流(Ic):500mA;集射极击穿电压(Vceo):25V;耗散功率(Pd):300mW;直流电流增益(hFE):120@500mA,1.0V;; LCSC Part Name: hFE:200-350，丝印:2TY S8550; Supplier Part: C20069126; Manufacturer: 宏嘉诚; Supplier Footprint: SOT-23; JLCPCB Part Class: Extended Part; Datasheet: https://atta.szlcsc.com/upload/public/pdf/source/20250107/6DAD7E9AA702AA129A4A0106BAAB5F5A.pdf; Supplier: LCSC; type: PNP; Current - Collector(Ic): 500mA; Collector - Emitter Voltage VCEO: 25V; Pd - Power Dissipation: 300mW; DC Current Gain: 120@500mA,1.0V; Transition frequency(fT): 150MHz; Current - Collector Cutoff: 100nA; Vce Saturation(VCE(sat)): 500mV; Operating Temperature: -55℃~+150℃
Q5-Q10 = NCE7560K: 类型:N沟道;漏源电压(Vdss):75V;连续漏极电流(Id):60A;功率(Pd):140W;导通电阻(RDS(on)@Vgs,Id):8.5mΩ@10V,30A;阈值电压(Vgs(th)@Id):4V@250uA;; LCSC Part Name: N沟道 75V 60A; Supplier Part: C95273; Manufacturer: NCE(无锡新洁能); Supplier Footprint: TO-252-2(DPAK); JLCPCB Part Class: Extended Part; Datasheet: https://atta.szlcsc.com/upload/public/pdf/source/20170211/1486785673842.pdf; Supplier: LCSC; Type: N沟道; Drain Source Voltage (Vdss): 75V; Continuous Drain Current (Id): 60A; Power Dissipation (Pd): 140W; Drain Source On Resistance (RDS(on)@Vgs,Id): 8.5mΩ@10V,30A; Gate Threshold Voltage (Vgs(th)@Id): 4V@250uA; Total Gate Charge (Qg@Vgs): 65nC@10V; Input Capacitance (Ciss@Vds): 4.03nF@40V; Reverse Transfer Capacitance (Crss@Vds): 35pF@40V; Operating Temperature: -55℃~+175℃@(Tj); Check: true
R1 R25 R29-R33 R37 R38 R46 R57 R62-R64 R78-R80 R88-R90 R95 R97 R98 R104 R106-R108 R111-R114 R122-R124 R127-R130 = 0603WAF1002T5E: 阻值:10kΩ;精度:±1%;功率:100mW;温度系数:±100ppm/℃;电阻类型:厚膜电阻;; LCSC Part Name: 10kΩ ±1% 100mW 厚膜电阻; Supplier Part: C25804; Manufacturer: UNI-ROYAL(厚声); Supplier Footprint: 0603; JLCPCB Part Class: Basic Part; Datasheet: https://atta.szlcsc.com/upload/public/pdf/source/20200306/C422600_1E6D84923E4A46A82E41ADD87F860B5C.pdf; Supplier: LCSC; Tolerance: ±1%; Power(Watts): 100mW; Overload Voltage (Max): 75V; Temperature Coefficient: ±100ppm/℃; Type: 厚膜电阻; Operating Temperature Range: -55℃~+155℃; Pin Type: IN; Check: true
R2 = RS-03L1504FT: 电阻类型:厚膜电阻;阻值:1.5MΩ;精度:±1%;功率:100mW;最大工作电压:50V;温度系数:±250ppm/℃;; LCSC Part Name: 1.5MΩ ±1% 100mW; Supplier Part: C322057; Manufacturer: FH(风华); Supplier Footprint: 0603; JLCPCB Part Class: Extended Part; Datasheet: https://atta.szlcsc.com/upload/public/pdf/source/20140616/1457707091974.pdf; Supplier: LCSC; Type: 厚膜电阻; Tolerance: ±1%; Power(Watts): 100mW; Overload Voltage (Max): 50V; Temperature Coefficient: ±250ppm/℃; Operating Temperature Range: -55℃~+155℃; Pin Type: IN; Check: true
R3 R5 = RS-03K1003FT: 阻值:100kΩ;功率:100mW;温度系数:±100ppm/℃;精度:±1%;; LCSC Part Name: 100kΩ ±1% 100mW; Supplier Part: C115320; Manufacturer: FH(风华); Supplier Footprint: 0603; JLCPCB Part Class: Extended Part; Datasheet: https://atta.szlcsc.com/upload/public/pdf/source/20140616/1457707091974.pdf; Supplier: LCSC; Power(Watts): 100mW; Overload Voltage (Max): 50V; Temperature Coefficient: ±100ppm/℃; Tolerance: ±1%; Operating Temperature Range: -55℃~+155℃; Pin Type: IN; Check: true
R4 R7 R17 R18 R50 R53 R59-R61 R70 R73 R75-R77 R117 R118 R120 R121 = 0603WAF220JT5E: 阻值:22Ω;精度:±1%;功率:100mW;温度系数:±100ppm/℃;电阻类型:厚膜电阻;; LCSC Part Name: 22Ω ±1% 100mW 厚膜电阻; Supplier Part: C23345; Manufacturer: UNI-ROYAL(厚声); Supplier Footprint: 0603; JLCPCB Part Class: Basic Part; Datasheet: https://atta.szlcsc.com/upload/public/pdf/source/20200306/C422600_1E6D84923E4A46A82E41ADD87F860B5C.pdf; Supplier: LCSC; Tolerance: ±1%; Power(Watts): 100mW; Overload Voltage (Max): 75V; Temperature Coefficient: ±100ppm/℃; Type: 厚膜电阻; Operating Temperature Range: -55℃~+155℃; Pin Type: IN; Check: true
R6 R8 R9 R14 R21 R22 R26 R28 R34 R40 = RC0603FR-071KL: 电阻类型:厚膜电阻;阻值:1kΩ;精度:±1%;功率:100mW;; LCSC Part Name: 1kΩ ±1% 100mW; Supplier Part: C22548; Manufacturer: YAGEO(国巨); Supplier Footprint: 0603; JLCPCB Part Class: Extended Part; Datasheet: https://atta.szlcsc.com/upload/public/pdf/source/20180312/7BD3618A8B6324EA6280B0497A051AB7.pdf; Supplier: LCSC; Type: 厚膜电阻; Tolerance: ±1%; Power(Watts): 100mW; Temperature Coefficient: ±100ppm/℃; Overload Voltage (Max): 75V; Operating Temperature Range: -55℃~+155℃; Pin Type: IN; Check: true
R10-R12 R23 R24 R47 R54 = RS-03000FT: 阻值:0Ω;精度:±1%;功率:100mW;; LCSC Part Name: 0Ω ±1% 100mW; Supplier Part: C136582; Manufacturer: FH(风华); Supplier Footprint: 0603; JLCPCB Part Class: Extended Part; Datasheet: https://atta.szlcsc.com/upload/public/pdf/source/20171106/C136582_15099532019501092527.pdf; Supplier: LCSC; Tolerance: ±1%; Power(Watts): 100mW; Overload Voltage (Max): 50V; Operating Temperature Range: -55℃~+155℃; Pin Type: IN; Check: true
R13 R16 = 0603WAF4533T5E: 阻值:453kΩ;精度:±1%;功率:100mW;温度系数:±100ppm/℃;电阻类型:厚膜电阻;; LCSC Part Name: 453kΩ ±1% 100mW 厚膜电阻; Supplier Part: C25818; Manufacturer: UNI-ROYAL(厚声); Supplier Footprint: 0603; JLCPCB Part Class: Extended Part; Datasheet: https://atta.szlcsc.com/upload/public/pdf/source/20200306/C422600_1E6D84923E4A46A82E41ADD87F860B5C.pdf; Supplier: LCSC; Tolerance: ±1%; Power(Watts): 100mW; Overload Voltage (Max): 75V; Temperature Coefficient: ±100ppm/℃; Type: 厚膜电阻; Operating Temperature Range: -55℃~+155℃; Pin Type: IN; Check: true
R15 R19 = RC0603FR-07100KL: 电阻类型:厚膜电阻;阻值:100kΩ;精度:±1%;功率:100mW;温度系数:±100ppm/℃;; LCSC Part Name: 厚膜电阻 100kΩ ±1% 100mW; Supplier Part: C14675; Manufacturer: YAGEO(国巨); Supplier Footprint: 0603; JLCPCB Part Class: Extended Part; Datasheet: https://atta.szlcsc.com/upload/public/pdf/source/20140324/1457707028752.pdf; Supplier: LCSC; Type: 厚膜电阻; Tolerance: ±1%; Power(Watts): 100mW; Temperature Coefficient: ±100ppm/℃; Overload Voltage (Max): 75V; Operating Temperature Range: -55℃~+155℃; Pin Type: IN; Check: true
R20 = 0603WAF4992T5E: 阻值:49.9kΩ;精度:±1%;功率:100mW;温度系数:±100ppm/℃;电阻类型:厚膜电阻;; LCSC Part Name: 49.9kΩ ±1% 100mW 厚膜电阻; Supplier Part: C23184; Manufacturer: UNI-ROYAL(厚声); Supplier Footprint: 0603; JLCPCB Part Class: Basic Part; Datasheet: https://atta.szlcsc.com/upload/public/pdf/source/20200306/C422600_1E6D84923E4A46A82E41ADD87F860B5C.pdf; Supplier: LCSC; Tolerance: ±1%; Power(Watts): 100mW; Overload Voltage (Max): 75V; Temperature Coefficient: ±100ppm/℃; Type: 厚膜电阻; Operating Temperature Range: -55℃~+155℃; Pin Type: IN; Check: true
R27 = R0603_S: Pin Type: IN; Manufacturer: UNI-ROYAL(厚声); Manufacturer Part: 0805W8F1001T5E; Supplier: LCSC; Supplier Part: C21189; 美岩编码: A00010; 单价: 0.009222; Check: true
R35 = 3386P-1-104: 阻值:100kΩ;精度:±10%;; LCSC Part Name: 100kΩ ±10%; Supplier Part: C118953; Manufacturer: BOCHEN(博晨); Supplier Footprint: 插件; JLCPCB Part Class: 扩展库; Datasheet: https://atta.szlcsc.com/upload/public/pdf/source/20181127/C330458_44D017D66B69382BB74132F70548D474.pdf; Supplier: LCSC; Tolerance: ±10%; Check: true
R36 = 0603WAF6202T5E: 阻值:62kΩ;精度:±1%;功率:100mW;温度系数:±100ppm/℃;电阻类型:厚膜电阻;; LCSC Part Name: 62kΩ ±1% 100mW 厚膜电阻; Supplier Part: C23221; Manufacturer: UNI-ROYAL(厚声); Supplier Footprint: 0603; JLCPCB Part Class: Basic Part; Datasheet: https://atta.szlcsc.com/upload/public/pdf/source/20200306/C422600_1E6D84923E4A46A82E41ADD87F860B5C.pdf; Supplier: LCSC; Tolerance: ±1%; Power(Watts): 100mW; Overload Voltage (Max): 75V; Temperature Coefficient: ±100ppm/℃; Type: 厚膜电阻; Operating Temperature Range: -55℃~+155℃; Pin Type: IN; 美岩编码: A00010; 单价: 0.009222; Check: true
R39 = 0603WAF1202T5E: 阻值:12kΩ;精度:±1%;功率:100mW;温度系数:±100ppm/℃;电阻类型:厚膜电阻;; LCSC Part Name: 12kΩ ±1% 100mW 厚膜电阻; Supplier Part: C22790; Manufacturer: UNI-ROYAL(厚声); Supplier Footprint: 0603; JLCPCB Part Class: Basic Part; Datasheet: https://atta.szlcsc.com/upload/public/pdf/source/20200306/C422600_1E6D84923E4A46A82E41ADD87F860B5C.pdf; Supplier: LCSC; Tolerance: ±1%; Power(Watts): 100mW; Overload Voltage (Max): 75V; Temperature Coefficient: ±100ppm/℃; Type: 厚膜电阻; Operating Temperature Range: -55℃~+155℃; Pin Type: IN; 美岩编码: A00010; 单价: 0.009222; Check: true
R41 R42 R51 R55 R65 R66 R71 R74 = RT0603BRD0720KL: 电阻类型:薄膜电阻;阻值:20kΩ;精度:±0.1%;功率:100mW;; LCSC Part Name: 20kΩ ±0.1% 100mW; Supplier Part: C723637; Manufacturer: YAGEO(国巨); Supplier Footprint: 0603; JLCPCB Part Class: Extended Part; Datasheet: https://atta.szlcsc.com/upload/public/pdf/source/20200814/C723637_57E5E8B3C02F5D5BA42E401EB3E82C8B.pdf; Supplier: LCSC; Type: 薄膜电阻; Tolerance: ±0.1%; Power(Watts): 100mW; Temperature Coefficient: ±25ppm/℃; Overload Voltage (Max): 75V; Operating Temperature Range: -55℃~+155℃; Pin Type: IN; Check: true
R43 R48 R56 R58 R110 R115 R116 R119 R125 R126 = R0603_S: Pin Type: IN; Supplier Part: C14675; Check: true
R44 R45 R49 R52 R67-R69 R72 = RT0603BRD071KL: 电阻类型:薄膜电阻;阻值:1kΩ;精度:±0.1%;功率:100mW;; LCSC Part Name: 1kΩ ±0.1% 100mW; Supplier Part: C110776; Manufacturer: YAGEO(国巨); Supplier Footprint: 0603; JLCPCB Part Class: Extended Part; Datasheet: https://atta.szlcsc.com/upload/public/pdf/source/20170704/1499151282044.pdf; Supplier: LCSC; Type: 薄膜电阻; Tolerance: ±0.1%; Power(Watts): 100mW; Temperature Coefficient: ±25ppm/℃; Overload Voltage (Max): 75V; Operating Temperature Range: -55℃~+155℃; Pin Type: IN; Check: true
R81-R83 R109 = LR2512D-3W-5mR-1%: 电阻类型:采样电阻;阻值:5mΩ;精度:±1%;功率:3W;温度系数:25ppm/℃~+50ppm/℃;安装方式:贴片;; LCSC Part Name: 5mΩ ±1% 3W; Supplier Part: C500739; Manufacturer: Milliohm(毫欧); Supplier Footprint: 2512; JLCPCB Part Class: Extended Part; Datasheet: https://atta.szlcsc.com/upload/public/pdf/source/20211008/27BCB003066C6550DC06C87D8395239C.pdf; Supplier: LCSC; Type: 采样电阻; Tolerance: ±1%; Power(Watts): 3W; Temperature Coefficient: 25ppm/℃~+50ppm/℃; Mounting Sytle: 贴片; Pin Type: IN; Check: true
R84-R87 R91-R94 = 0603WAF1502T5E: 阻值:15kΩ;精度:±1%;功率:100mW;温度系数:±100ppm/℃;电阻类型:厚膜电阻;; LCSC Part Name: 15kΩ ±1% 100mW 厚膜电阻; Supplier Part: C22809; Manufacturer: UNI-ROYAL(厚声); Supplier Footprint: 0603; JLCPCB Part Class: Basic Part; Datasheet: https://atta.szlcsc.com/upload/public/pdf/source/20200306/C422600_1E6D84923E4A46A82E41ADD87F860B5C.pdf; Supplier: LCSC; Tolerance: ±1%; Power(Watts): 100mW; Overload Voltage (Max): 75V; Temperature Coefficient: ±100ppm/℃; Type: 厚膜电阻; Operating Temperature Range: -55℃~+155℃; Pin Type: IN; Check: true
R96 = 0603WAF1200T5E: 阻值:120Ω;精度:±1%;功率:100mW;温度系数:±100ppm/℃;电阻类型:厚膜电阻;; LCSC Part Name: 120Ω ±1% 100mW 厚膜电阻; Supplier Part: C22787; Manufacturer: UNI-ROYAL(厚声); Supplier Footprint: 0603; JLCPCB Part Class: Basic Part; Datasheet: https://atta.szlcsc.com/upload/public/pdf/source/20200306/C422600_1E6D84923E4A46A82E41ADD87F860B5C.pdf; Supplier: LCSC; Tolerance: ±1%; Power(Watts): 100mW; Overload Voltage (Max): 75V; Temperature Coefficient: ±100ppm/℃; Type: 厚膜电阻; Operating Temperature Range: -55℃~+155℃; Pin Type: IN; Check: true
R99-R102 = 0603WAF2001T5E: 阻值:2kΩ;精度:±1%;功率:100mW;温度系数:±100ppm/℃;电阻类型:厚膜电阻;; LCSC Part Name: 2kΩ ±1% 100mW 厚膜电阻; Supplier Part: C22975; Manufacturer: UNI-ROYAL(厚声); Supplier Footprint: 0603; JLCPCB Part Class: Basic Part; Datasheet: https://atta.szlcsc.com/upload/public/pdf/source/20200306/C422600_1E6D84923E4A46A82E41ADD87F860B5C.pdf; Supplier: LCSC; Tolerance: ±1%; Power(Watts): 100mW; Overload Voltage (Max): 75V; Temperature Coefficient: ±100ppm/℃; Type: 厚膜电阻; Operating Temperature Range: -55℃~+155℃; Pin Type: IN; Check: true
R105 = RS-03K1002FT: 精度:±1%;温度系数:±100ppm/℃;阻值:10kΩ;功率:100mW;最大工作电压:50V;工作温度范围:-55℃~+155℃;; LCSC Part Name: 10KΩ(1002) ±1%; Supplier Part: C115324; Manufacturer: FH(风华); Supplier Footprint: 0603; JLCPCB Part Class: Extended Part; Datasheet: https://atta.szlcsc.com/upload/public/pdf/source/20170704/1499151311434.pdf; Supplier: LCSC; Tolerance: ±1%; Temperature Coefficient: ±100ppm/℃; Power(Watts): 100mW; Overload Voltage (Max): 50V; Operating Temperature Range: -55℃~+155℃; Pin Type: IN; Check: true
U1 = STM32G431RBT6: Supplier Part: C431633; Manufacturer: ST(意法半导体); Supplier Footprint: LQFP-64(10x10); JLCPCB Part Class: ExtendedPart; Datasheet: https://atta.szlcsc.com/upload/public/pdf/source/20190925/C431633_8068E60CC825A086DCCD86A4BDED9458.pdf; Supplier: LCSC; Check: true
U2 = LM5164DDAR: 功能类型:降压型;输出类型:可调;输入电压:6V~100V;输出电压:1.2V~100V;输出电流(最大值):1A;; LCSC Part Name: 降压型 输入6V~100V 输出1.2V~100V 1A; Supplier Part: C477928; Manufacturer: TI(德州仪器); Supplier Footprint: SO-8-EP; JLCPCB Part Class: Extended Part; Datasheet: https://atta.szlcsc.com/upload/public/pdf/source/20200102/C477928_A6130A40DCA2C193067E68A47DE8CF0C.pdf; Supplier: LCSC; Function: 降压型; Synchronous Rectification: 是; Output Type: 可调; Number of Outputs: 1; Topology: 降压式; Input Voltage: 6V~100V; Output Voltage: 1.2V~100V; Output Current (Max): 1A; Switching Frequency: 1MHz; Operating Temperature: -40℃~+150℃@(TJ); Check: true
U3 = XC6210B332MR_C424705: 输出类型:固定;输出极性:正;最大输入电压:6V;输出电压:3.3V;输出电流:900mA;电源纹波抑制比(PSRR):60dB@(1kHz);; Supplier Part: C424705; Manufacturer: TOREX(特瑞仕); Supplier Footprint: SOT-25; JLCPCB Part Class: Extended Part; Datasheet: https://atta.szlcsc.com/upload/public/pdf/source/20190903/C424705_1DFB2113A9A78D399905DBF688657204.pdf; Supplier: LCSC; Output Type: 固定; Output Polarity: 正; Number of Outputs: 1; Maximum Input Voltage: 6V; Output Voltage: 3.3V; Dropout Voltage: 75mV@(100mA); Output Current: 900mA; Power Supply Rejection Ratio (PSRR): 60dB@(1kHz); Power Supply Rejection Ratio (PRSS): 90dB@(100Hz),60dB@(100kHz); Check: true
U4 = LP5907QMFX-3.3Q1: 输出类型:固定;输出极性:正;最大输入电压:5.5V;输出电压:3.3V;输出电流:250mA;电源纹波抑制比(PSRR):90dB;; Supplier Part: C130005; Manufacturer: TI(德州仪器); Supplier Footprint: SOT-23-5; JLCPCB Part Class: Extended Part; Datasheet: https://atta.szlcsc.com/upload/public/pdf/source/20170918/C130005_1505703244961975089.pdf; Supplier: LCSC; Output Type: 固定; Output Polarity: 正; Number of Outputs: 1; Maximum Input Voltage: 5.5V; Output Voltage: 3.3V; Dropout Voltage: 250mV@(250mA); Output Current: 250mA; Power Supply Rejection Ratio (PSRR): 90dB; Power Supply Rejection Ratio (PRSS): 90dB@(100Hz),60dB@(100kHz); Check: true
U5 = TD1466: Supplier: LCSC; Supplier Part: C185109; Manufacturer: JoulWatt Tech; Manufacturer Part: JW5026; JLCPCB Part Class: Extended Part; Check: true
U6 = LM321MF/NOPB: 放大器组数:1;; Supplier Part: C131103; Manufacturer: TI(德州仪器); Supplier Footprint: SOT-23-5; JLCPCB Part Class: ExtendedPart; Datasheet: https://atta.szlcsc.com/upload/public/pdf/source/20180528/C131103_48811F2B458DDCB2A659958D3ACA9936.pdf; Supplier: LCSC; Number of Circuits: 1; Check: true
U7 = FD6288Q: Supplier Part: C328453; Manufacturer: Fortior Tech(峰岹); Supplier Footprint: QFN-24-EP(4x4); JLCPCB Part Class: 扩展库; Datasheet: https://atta.szlcsc.com/upload/public/pdf/source/20181108/C328453_785547738DB9FC0123219FC22539EFAD.pdf; Supplier: LCSC; Check: true
U8 = WAFER-GH1.25-5PWB: 参考系列:GH;间距:1.25mm;插针结构:1x5P;排数:1;每排PIN数:5;公母:公型插针;安装方式:卧贴;额定电流:1A;工作温度范围:-25℃~+85℃;; LCSC Part Name: GH 1.25mm 1x5P 卧贴 带扣; Supplier Part: C3029380; Manufacturer: XUNPU(讯普); Supplier Footprint: SMD,P=1.25mm; JLCPCB Part Class: 扩展库; Datasheet: https://atta.szlcsc.com/upload/public/pdf/source/20220527/CB8773BFB0913C3B8ABD62CB38BA101A.pdf; Supplier: LCSC; Reference Series: GH; Pitch: 1.25mm; Pins Structure: 1x5P; Number of Rows: 1; Number of PINs Per Row: 5; Gender: 公型插针; Mounting Style: 卧贴; Current Rating (Max): 1A; Operating Temperature Range: -25℃~+85℃; Check: true
U9 = TJA1051TK/3/1J: Supplier Part: C2875699; Manufacturer: NXP(恩智浦); Supplier Footprint: VDFN-8; JLCPCB Part Class: ExtendedPart; Datasheet: https://atta.szlcsc.com/upload/public/pdf/source/20210128/C2671135_A82E49CDEFC20634F2534E8F261E286A.pdf; Supplier: LCSC; Check: true
U10 = RS624XQ: 超低噪声11nV/√Hz,7MHz,4通道运放; LCSC Part Name: 低噪声运放RS624XQ; Supplier Part: C237013; Manufacturer: RUNIC(润石); Supplier Footprint: TSSOP-14; JLCPCB Part Class: Extended Part; Datasheet: https://atta.szlcsc.com/upload/public/pdf/source/20180629/C237015_68A12BBC706A117D231179E6ED270A16.pdf; Supplier: LCSC; Number of Circuits: 4; Rail to Rail: 轨到轨; Slew Rate(SR): 0.5V/us; Current - Input Bias(Ib): 1pA; Gain Bandwidth Product(GBP): 1.1MHz; Output Current: 55mA; Operating Temperature: -40℃~+125℃; Check: true
U11 = LM358_C2984960: Supplier Part: C2984960; Manufacturer: HX(恒佳兴); Supplier Footprint: SOP-8; JLCPCB Part Class: ExtendedPart; Datasheet: https://atta.szlcsc.com/upload/public/pdf/source/20220411/BF8A74874B47C6BB2B58E6B995D1DE82.pdf; Supplier: LCSC; Check: true
U17 = GS4157B-CR: 开关电路:-;通道数:1;导通电阻(Ron@VCC):800mΩ;; Supplier Part: C840035; Manufacturer: Gainsil(聚洵); Supplier Footprint: SC-70-6; JLCPCB Part Class: 扩展库; Datasheet: https://atta.szlcsc.com/upload/public/pdf/source/20220610/2A35EEEA3768DDA130F8C36B48DE8A34.pdf; Supplier: LCSC; Number of Channels: 1; Supply Voltage: 1.8V~5.5V; Turn-on time: 28ns; On-State Resistance (Max): 800mΩ; Turn-off time: 23ns; Operating Temperature: -40℃~+125℃
U18 = W25Q16JVUXIQ: Supplier Part: C2843335; Manufacturer: WINBOND(华邦); Supplier Footprint: USON-8-EP(2x3); JLCPCB Part Class: 扩展库; Datasheet: https://atta.szlcsc.com/upload/public/pdf/source/20210629/C2843335_FB4D78B5076715625DC0C83F790D3044.pdf; Supplier: LCSC
USBC1 = TYPE-C-31-M-12: 连接器类型:Type-C;标准:-;公母:母座;触点数量:16;端口数量:1;额定电流 - 电源:250mA;; Supplier Part: C165948; Manufacturer: 韩国韩荣; JLCPCB Part Class: ExtendedPart; Datasheet: https://atta.szlcsc.com/upload/public/pdf/source/20210111/C2682493_D8CCFED08835E878D16ACCF4460E43B8.pdf; Supplier: LCSC; Connector Type: Type-C; Gender: 母座; Number of Contacts: 16; Number of Ports: 1; Current Rating - Power (Max): 250mA; Check: true
X1 = X32258MSB4SI: 频率:8MHz;负载电容:20pF;频率公差:±10ppm;; LCSC Part Name: 8MHz ±10ppm 20pF YSX321SL; Supplier Part: C2682774; Manufacturer: YXC(扬兴晶振); Supplier Footprint: SMD3225-4P; JLCPCB Part Class: Extended Part; Datasheet: https://atta.szlcsc.com/upload/public/pdf/source/20210106/C2682774_0CD4FDA5D9DA3FBEEC23BD607A48E4B0.pdf; Supplier: LCSC; Crystal Type: 贴片无源晶振; Load Capacitance: 20pF; Frequency Tolerance: ±10ppm; Frequency Stability: ±30ppm; Operating Temperature: -40℃~+85℃; Check: true

## Nets
5V: C30.2 C36.2 C41.2 C47.2 CN7.1 D14.1(-) D19.1(-) D20.1(-) D24.1(-) J1.15(1) LED1.3(VDD) R26.2 R27.2 U3.1(VIN) U3.3(CE) U4.1(IN) U4.3(EN) U8.5 U9.3(VCC)
12V: C22.1 C26.1 C27.2 C28.2 C29.2 C37.1 C38.2 C39.1 C58.2 C59.2 C60.2 C69.2 CN4.1 D8.2 D9.2 D10.2 L2.2 R16.1 R25.2 R38.2 U5.5(VIN) U7.4(VCC)
24V: R110.1
AGND: C42.1 C43.1 C54.1 C61.1 C62.1 C67.1 C68.1 R12.1 R57.1 U1.27(VSSA) U6.2(V-) U10.11(V-)
AVCC: C42.2 C43.2 CN8.1 R46.2 U1.28(VREF+) U1.29(VDDA) U4.5(OUT) U6.5(V+) U10.4(V+)
GND: C23.1 C24.1 C26.2 C27.1 C28.1 C29.1 C30.1 C31.1 C32.1 C33.1 C34.1 C35.1 C36.1 C37.2 C38.1 C39.2 C41.1 C44.1 C45.1 C46.1 C47.1 C48.1 C49.1 C50.1 C51.1 C52.1 C53.1 C55.1 C56.1 C57.1 C58.1 C59.1 C60.1 C69.1 C75.1 C76.1 C77.1 C78.1 C80.1 C81.1 C82.2 C83.2 C84.2 C85.2 C86.2 C87.2 C88.2 C89.2 C90.1 C91.2 C92.2 C93.2 C94.2 C95.2 C105.2 C106.1 CN6.1 CN9.6 CN9.7 CN9.8 CN11.3 CN11.4 CN34.3 CN34.4 CN47.6 CN47.7 CN47.8 D22.3(A) IPSLCD1.2(GND) IPSLCD1.9(GND) IPSLCD1.10(GND) K1.1 K2.1 K3.1 K4.1 K5.1 L1.2 L3.2 L4.2 L5.2 L6.2 L8.2 L9.2 LED1.1(GND) NTC2.2 R10.2 R11.2 R12.2 R19.2 R20.2 R23.1 R23.2 R24.1 R24.2 R35.3 R39.2 R99.2 R100.2 R101.2 R102.2 R105.2 R106.2 R107.2 R108.2 R119.2 U1.15(VSS) U1.31(VSS) U1.47(VSS) U1.63(VSS) U2.1(GND) U2.9(EP) U3.2(VSS) U4.2(GND) U5.2(GND) U7.6(COM) U7.25(EP) U8.1 U8.6 U8.7 U9.2(GND) U9.8(S) U9.9(EP) U17.2(VSS) U18.4(GND) U18.9(EP) USBC1.0 USBC1.A1(GND) USBC1.A12(GND) USBC1.B1(GND) USBC1.B12(GND) X1.2(GND) X1.4(GND)
PGND: C3.2 C4.2 C5.1 C6.1 C7.1 C8.1 C9.1 C10.1 C11.1 C12.1 C13.1 C14.1 C15.1 C19.2 C20.2 C96.1 C97.1 C98.1 C99.1 C100.1 C101.1 C102.1 C103.1 C104.1 CN41.4 CN41.5 D3.2(A) Q3.3(S) R9.2 R10.1 R11.1 R44.1 R109.2
PGND_IN: C16.1 C17.1 C18.2 CN3.2 D2.1(K) D4.2(A) Q3.2(D)
